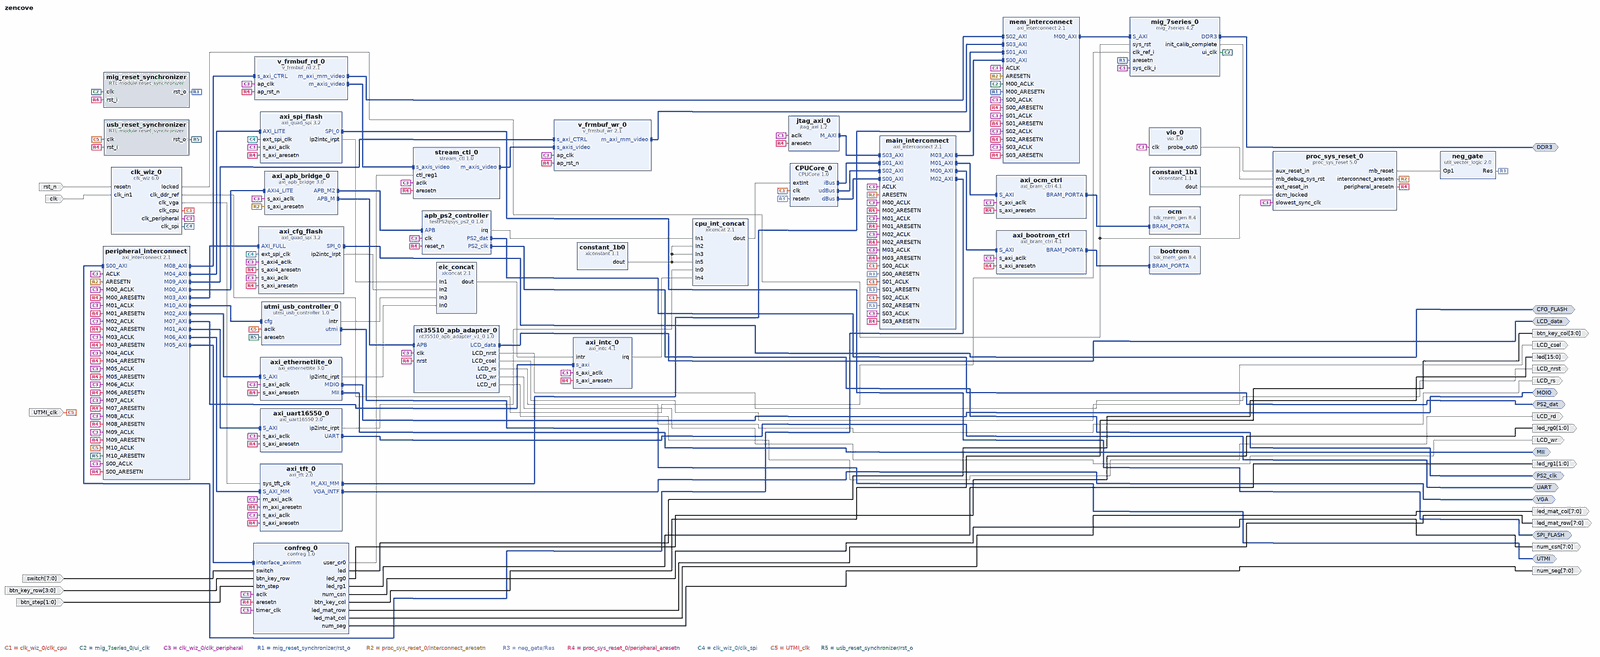
[diagram p0: block diagram of the top level, whole]
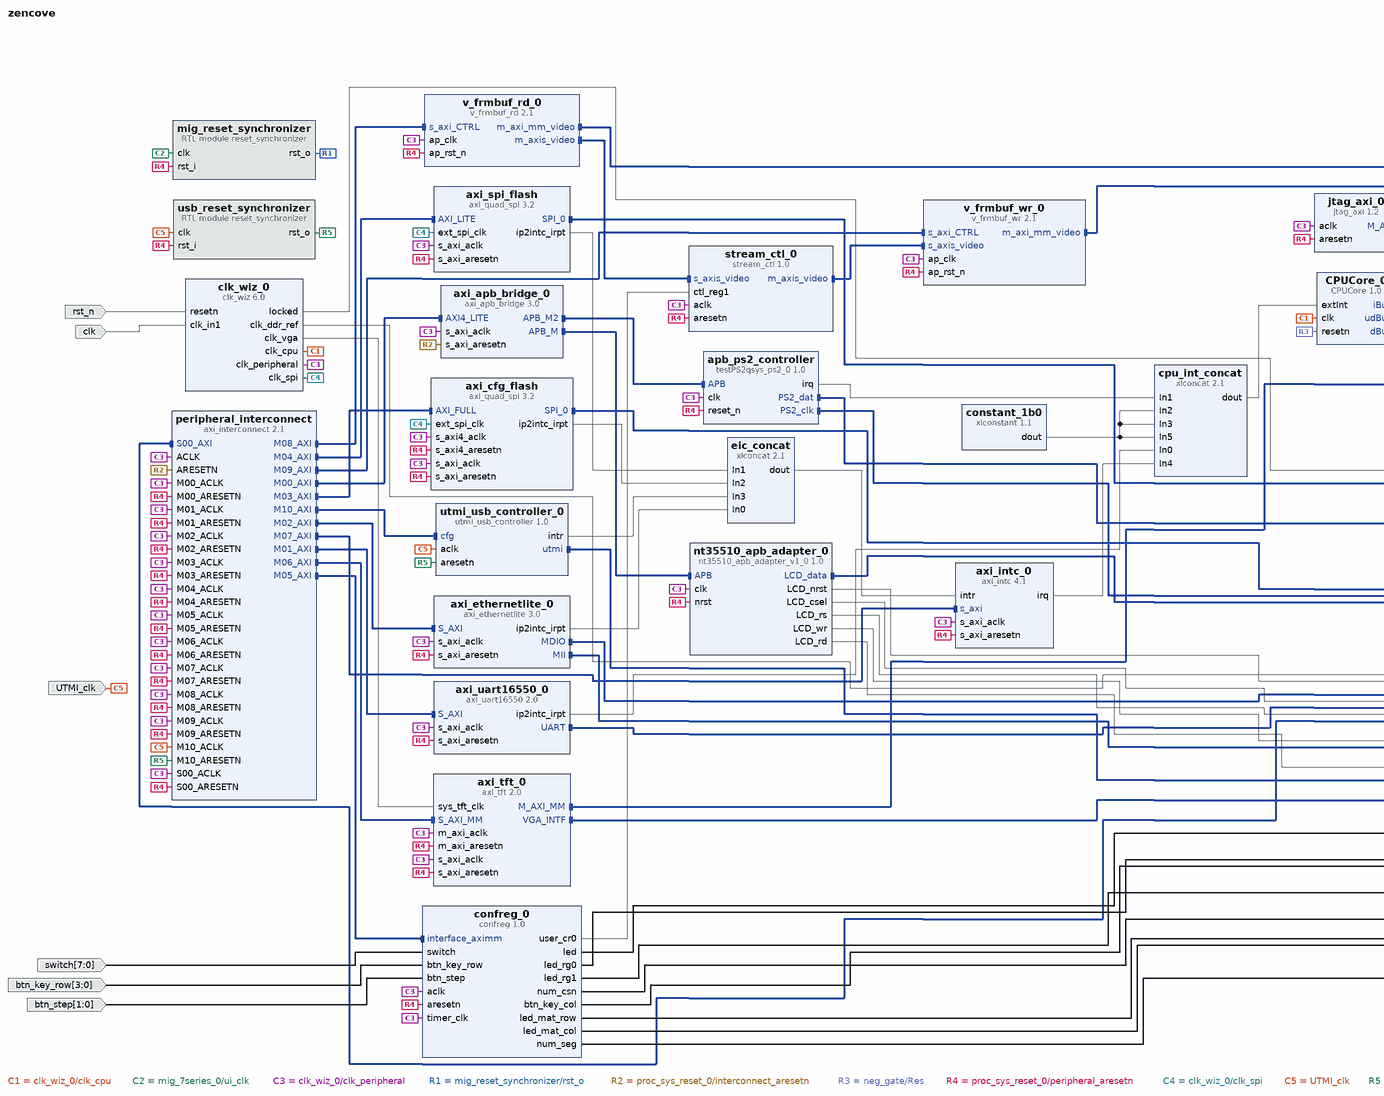
[diagram p1: block diagram of the top level, left part]
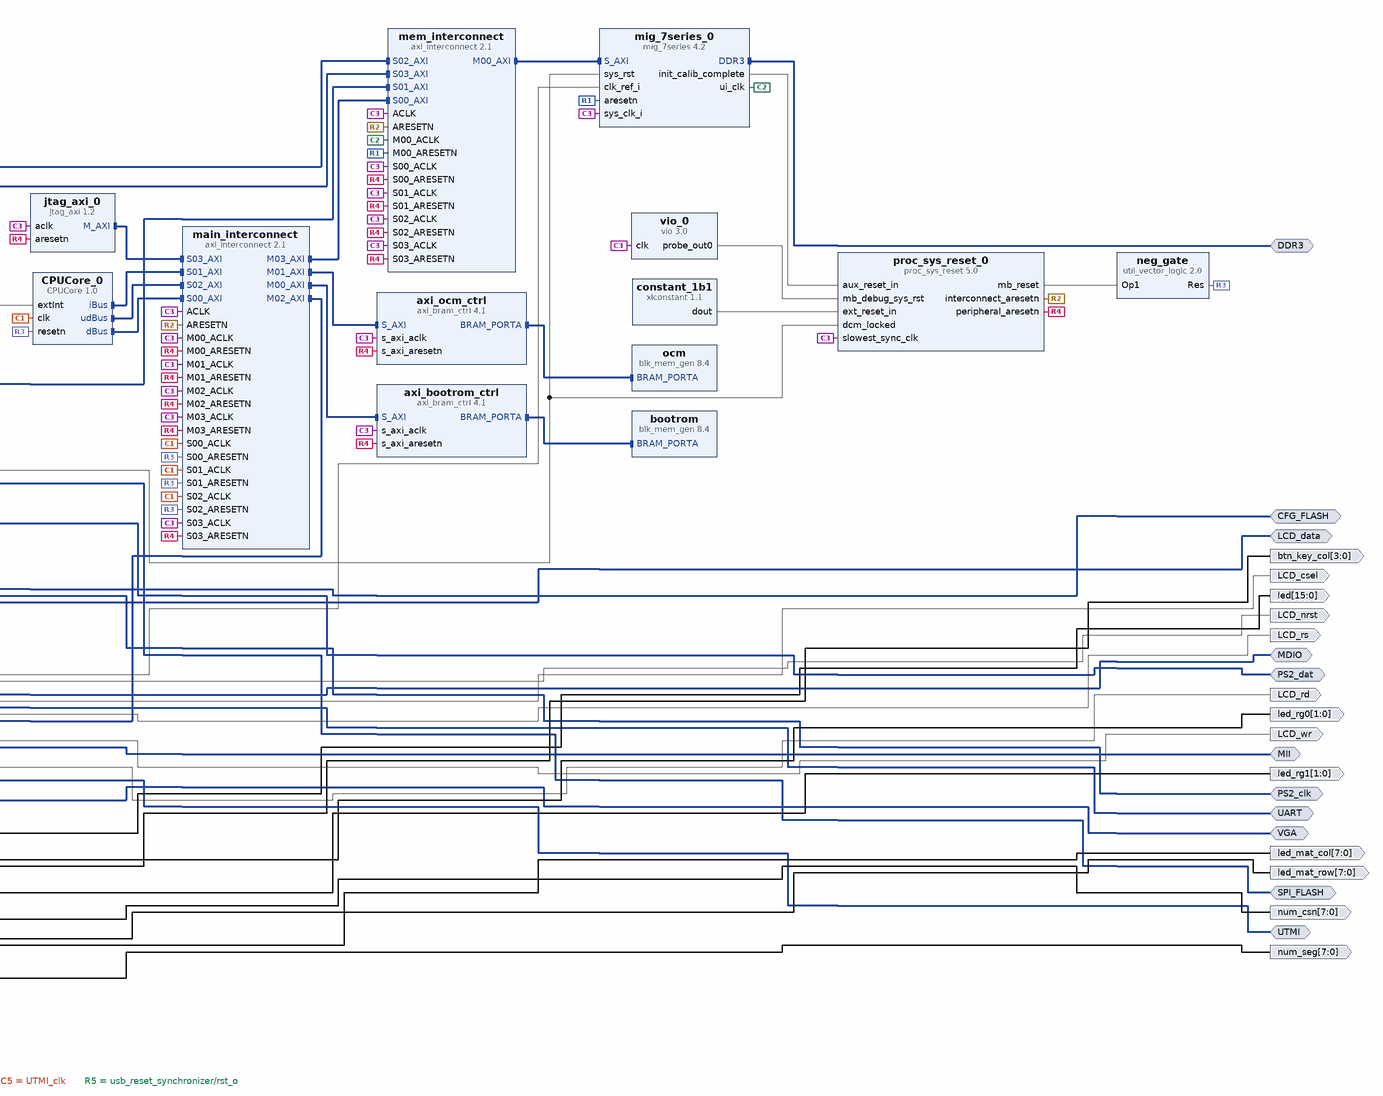
[diagram p2: block diagram of the top level, right part]
# Vivado block design zencove, xc7a200tfbg676-2, Vivado 2019.2
create_bd_design zencove

create_bd_intf_port -mode Master -vlnv xilinx.com:interface:ddrx_rtl:1.0 DDR3
create_bd_intf_port -mode Master -vlnv xilinx.com:interface:vga_rtl:1.0 VGA
create_bd_intf_port -mode Master -vlnv xilinx.com:interface:spi_rtl:1.0 SPI_FLASH
create_bd_intf_port -mode Master -vlnv xilinx.com:interface:spi_rtl:1.0 CFG_FLASH
create_bd_intf_port -mode Master -vlnv xilinx.com:interface:mii_rtl:1.0 MII
create_bd_intf_port -mode Master -vlnv xilinx.com:interface:mdio_rtl:1.0 MDIO
create_bd_intf_port -mode Master -vlnv xilinx.com:interface:uart_rtl:1.0 UART
create_bd_intf_port -mode Master -vlnv xilinx.com:interface:gpio_rtl:1.0 PS2_clk
create_bd_intf_port -mode Master -vlnv xilinx.com:interface:gpio_rtl:1.0 PS2_dat
create_bd_intf_port -mode Master -vlnv xilinx.com:interface:gpio_rtl:1.0 LCD_data
create_bd_intf_port -mode Master -vlnv harrychen.xyz:user:utmi_rtl:1.0 UTMI
create_bd_port -dir I -type rst rst_n
create_bd_port -dir I -type clk clk
create_bd_port -dir O -from 15 -to 0 led
create_bd_port -dir O -from 1 -to 0 led_rg0
create_bd_port -dir O -from 1 -to 0 led_rg1
create_bd_port -dir O -from 7 -to 0 num_csn
create_bd_port -dir O -from 3 -to 0 btn_key_col
create_bd_port -dir I -from 7 -to 0 switch
create_bd_port -dir I -from 3 -to 0 btn_key_row
create_bd_port -dir I -from 1 -to 0 btn_step
create_bd_port -dir O LCD_nrst
create_bd_port -dir O LCD_csel
create_bd_port -dir O LCD_rs
create_bd_port -dir O LCD_wr
create_bd_port -dir O LCD_rd
create_bd_port -dir I -type clk UTMI_clk
set_property -dict {CONFIG.FREQ_HZ 60000000} [get_bd_ports UTMI_clk]
create_bd_port -dir O -from 7 -to 0 led_mat_row
create_bd_port -dir O -from 7 -to 0 led_mat_col
create_bd_port -dir O -from 7 -to 0 num_seg

create_bd_cell -type ip -vlnv xilinx.com:ip:clk_wiz:6.0 clk_wiz_0
set_property -dict [list \
  CONFIG.CLKOUT1_JITTER 127.801 \
  CONFIG.CLKOUT1_PHASE_ERROR 87.180 \
  CONFIG.CLKOUT1_REQUESTED_OUT_FREQ 60 \
  CONFIG.CLKOUT2_JITTER 102.086 \
  CONFIG.CLKOUT2_PHASE_ERROR 87.180 \
  CONFIG.CLKOUT2_REQUESTED_OUT_FREQ 200.000 \
  CONFIG.CLKOUT2_USED true \
  CONFIG.CLKOUT3_JITTER 162.167 \
  CONFIG.CLKOUT3_PHASE_ERROR 87.180 \
  CONFIG.CLKOUT3_REQUESTED_OUT_FREQ 20.000 \
  CONFIG.CLKOUT3_USED true \
  CONFIG.CLKOUT4_JITTER 115.831 \
  CONFIG.CLKOUT4_PHASE_ERROR 87.180 \
  CONFIG.CLKOUT4_USED true \
  CONFIG.CLKOUT5_JITTER 154.057 \
  CONFIG.CLKOUT5_PHASE_ERROR 87.180 \
  CONFIG.CLKOUT5_REQUESTED_OUT_FREQ 25.000 \
  CONFIG.CLKOUT5_USED true \
  CONFIG.CLK_OUT1_PORT clk_cpu \
  CONFIG.CLK_OUT2_PORT clk_ddr_ref \
  CONFIG.CLK_OUT3_PORT clk_spi \
  CONFIG.CLK_OUT4_PORT clk_peripheral \
  CONFIG.CLK_OUT5_PORT clk_vga \
  CONFIG.MMCM_CLKFBOUT_MULT_F 12.000 \
  CONFIG.MMCM_CLKOUT0_DIVIDE_F 20.000 \
  CONFIG.MMCM_CLKOUT1_DIVIDE 6 \
  CONFIG.MMCM_CLKOUT2_DIVIDE 60 \
  CONFIG.MMCM_CLKOUT3_DIVIDE 12 \
  CONFIG.MMCM_CLKOUT4_DIVIDE 48 \
  CONFIG.NUM_OUT_CLKS 5 \
  CONFIG.RESET_PORT resetn \
  CONFIG.RESET_TYPE ACTIVE_LOW \
] [get_bd_cells clk_wiz_0]
create_bd_cell -type ip -vlnv xilinx.com:ip:vio:3.0 vio_0
set_property -dict {CONFIG.C_NUM_PROBE_IN 0} [get_bd_cells vio_0]
create_bd_cell -type ip -vlnv xilinx.com:ip:xlconstant:1.1 constant_1b0
set_property -dict {CONFIG.CONST_VAL 0} [get_bd_cells constant_1b0]
create_bd_cell -type ip -vlnv xilinx.com:ip:proc_sys_reset:5.0 proc_sys_reset_0
set_property -dict {CONFIG.C_AUX_RESET_HIGH 0} [get_bd_cells proc_sys_reset_0]
create_bd_cell -type ip -vlnv xilinx.com:ip:xlconcat:2.1 cpu_int_concat
set_property -dict {CONFIG.NUM_PORTS 6} [get_bd_cells cpu_int_concat]
create_bd_cell -type ip -vlnv xilinx.com:ip:util_vector_logic:2.0 neg_gate
set_property -dict {CONFIG.C_OPERATION not CONFIG.C_SIZE 1} [get_bd_cells neg_gate]
create_bd_cell -type ip -vlnv xilinx.com:ip:jtag_axi:1.2 jtag_axi_0
create_bd_cell -type ip -vlnv xilinx.com:ip:axi_interconnect:2.1 main_interconnect
set_property -dict [list \
  CONFIG.ENABLE_ADVANCED_OPTIONS 1 \
  CONFIG.NUM_MI 4 \
  CONFIG.NUM_SI 4 \
  CONFIG.S00_HAS_DATA_FIFO 2 \
  CONFIG.S01_ARB_PRIORITY 1 \
  CONFIG.S01_HAS_DATA_FIFO 2 \
  CONFIG.S02_ARB_PRIORITY 2 \
  CONFIG.S02_HAS_DATA_FIFO 2 \
  CONFIG.S03_ARB_PRIORITY 3 \
  CONFIG.S03_HAS_DATA_FIFO 2 \
  CONFIG.STRATEGY 2 \
] [get_bd_cells main_interconnect]
create_bd_cell -type ip -vlnv xilinx.com:ip:axi_interconnect:2.1 peripheral_interconnect
set_property -dict {CONFIG.NUM_MI 11 CONFIG.S00_HAS_DATA_FIFO 2 CONFIG.STRATEGY 2} [get_bd_cells peripheral_interconnect]
create_bd_cell -type ip -vlnv xilinx.com:ip:axi_bram_ctrl:4.1 axi_bootrom_ctrl
set_property -dict {CONFIG.SINGLE_PORT_BRAM 1} [get_bd_cells axi_bootrom_ctrl]
create_bd_cell -type ip -vlnv xilinx.com:ip:axi_bram_ctrl:4.1 axi_ocm_ctrl
set_property -dict {CONFIG.SINGLE_PORT_BRAM 1} [get_bd_cells axi_ocm_ctrl]
create_bd_cell -type ip -vlnv xilinx.com:ip:blk_mem_gen:8.4 bootrom
set_property -dict [list \
  CONFIG.Coe_File ../../../../../../bootloader.coe \
  CONFIG.EN_SAFETY_CKT false \
  CONFIG.Enable_32bit_Address true \
  CONFIG.Fill_Remaining_Memory_Locations true \
  CONFIG.Load_Init_File true \
  CONFIG.Register_PortA_Output_of_Memory_Primitives false \
  CONFIG.Use_RSTA_Pin true \
  CONFIG.Write_Depth_A 32768 \
  CONFIG.use_bram_block Stand_Alone \
] [get_bd_cells bootrom]
create_bd_cell -type ip -vlnv xilinx.com:ip:blk_mem_gen:8.4 ocm
set_property -dict [list \
  CONFIG.EN_SAFETY_CKT false \
  CONFIG.Enable_32bit_Address true \
  CONFIG.Register_PortA_Output_of_Memory_Primitives false \
  CONFIG.Use_RSTA_Pin true \
  CONFIG.use_bram_block BRAM_Controller \
] [get_bd_cells ocm]
create_bd_cell -type ip -vlnv xilinx.com:ip:xlconcat:2.1 eic_concat
set_property -dict {CONFIG.NUM_PORTS 4} [get_bd_cells eic_concat]
create_bd_cell -type ip -vlnv xilinx.com:ip:v_frmbuf_rd:2.1 v_frmbuf_rd_0
set_property -dict [list \
  CONFIG.AXIMM_DATA_WIDTH 64 \
  CONFIG.C_M_AXI_MM_VIDEO_DATA_WIDTH 64 \
  CONFIG.HAS_RGB8 0 \
  CONFIG.HAS_RGBX8 1 \
  CONFIG.MAX_COLS 1024 \
  CONFIG.MAX_ROWS 768 \
  CONFIG.SAMPLES_PER_CLOCK 1 \
] [get_bd_cells v_frmbuf_rd_0]
create_bd_cell -type ip -vlnv xilinx.com:ip:v_frmbuf_wr:2.1 v_frmbuf_wr_0
set_property -dict [list \
  CONFIG.AXIMM_DATA_WIDTH 64 \
  CONFIG.C_M_AXI_MM_VIDEO_DATA_WIDTH 64 \
  CONFIG.HAS_RGB8 0 \
  CONFIG.HAS_RGBX8 1 \
  CONFIG.MAX_COLS 1024 \
  CONFIG.MAX_ROWS 768 \
  CONFIG.SAMPLES_PER_CLOCK 1 \
] [get_bd_cells v_frmbuf_wr_0]
create_bd_cell -type ip -vlnv user.org:user:stream_ctl:1.0 stream_ctl_0
create_bd_cell -type ip -vlnv xilinx.com:ip:axi_interconnect:2.1 mem_interconnect
set_property -dict [list \
  CONFIG.NUM_MI 1 \
  CONFIG.NUM_SI 4 \
  CONFIG.S00_HAS_DATA_FIFO 0 \
  CONFIG.S01_HAS_DATA_FIFO 0 \
  CONFIG.S02_HAS_DATA_FIFO 0 \
  CONFIG.S03_HAS_DATA_FIFO 0 \
  CONFIG.STRATEGY 1 \
] [get_bd_cells mem_interconnect]
create_bd_cell -type ip -vlnv xilinx.com:ip:axi_apb_bridge:3.0 axi_apb_bridge_0
set_property -dict {CONFIG.C_APB_NUM_SLAVES 2 CONFIG.C_M_APB_PROTOCOL apb4} [get_bd_cells axi_apb_bridge_0]
create_bd_cell -type ip -vlnv xilinx.com:ip:axi_uart16550:2.0 axi_uart16550_0
create_bd_cell -type ip -vlnv xilinx.com:ip:axi_ethernetlite:3.0 axi_ethernetlite_0
create_bd_cell -type ip -vlnv xilinx.com:ip:axi_quad_spi:3.2 axi_cfg_flash
set_property -dict {CONFIG.C_SPI_MEMORY 3 CONFIG.C_TYPE_OF_AXI4_INTERFACE 1 CONFIG.C_XIP_MODE 1} [get_bd_cells axi_cfg_flash]
create_bd_cell -type ip -vlnv xilinx.com:ip:axi_quad_spi:3.2 axi_spi_flash
set_property -dict {CONFIG.C_FIFO_DEPTH 256 CONFIG.C_SPI_MODE 2 CONFIG.C_USE_STARTUP 0} [get_bd_cells axi_spi_flash]
create_bd_cell -type ip -vlnv xilinx.com:ip:axi_tft:2.0 axi_tft_0
set_property -dict {CONFIG.C_EN_I2C_INTF 0 CONFIG.C_MAX_BURST_LEN 128 CONFIG.C_TFT_INTERFACE 0} [get_bd_cells axi_tft_0]
create_bd_cell -type module -reference reset_synchronizer mig_reset_synchronizer
create_bd_cell -type ip -vlnv user.org:user:nt35510_apb_adapter_v1_0:1.0 nt35510_apb_adapter_0
create_bd_cell -type ip -vlnv xilinx.com:ip:axi_intc:4.1 axi_intc_0
set_property -dict {CONFIG.C_IRQ_CONNECTION 1} [get_bd_cells axi_intc_0]
create_bd_cell -type ip -vlnv user.org:user:testPS2qsys_ps2_0:1.0 apb_ps2_controller
create_bd_cell -type ip -vlnv xilinx.com:ip:xlconstant:1.1 constant_1b1
create_bd_cell -type module -reference reset_synchronizer usb_reset_synchronizer
create_bd_cell -type ip -vlnv xilinx.com:ip:mig_7series:4.2 mig_7series_0
set_property -dict [list \
  CONFIG.BOARD_MIG_PARAM Custom \
  CONFIG.MIG_DONT_TOUCH_PARAM Custom \
  CONFIG.RESET_BOARD_INTERFACE Custom \
  CONFIG.XML_INPUT_FILE mig_a.prj \
] [get_bd_cells mig_7series_0]
create_bd_cell -type ip -vlnv user.org:user:confreg:1.0 confreg_0
create_bd_cell -type ip -vlnv jiege.ch:user:utmi_usb_controller:1.0 utmi_usb_controller_0
create_bd_cell -type ip -vlnv user.org:user:CPUCore:1.0 CPUCore_0

# ---- connections ----

connect_bd_intf_net -intf_net testPS2qsys_ps2_0_0_PS2_dat [get_bd_intf_ports PS2_dat] [get_bd_intf_pins apb_ps2_controller/PS2_dat]
connect_bd_intf_net [get_bd_intf_ports LCD_data] [get_bd_intf_pins nt35510_apb_adapter_0/LCD_data]
connect_bd_intf_net [get_bd_intf_pins main_interconnect/M03_AXI] [get_bd_intf_pins mem_interconnect/S00_AXI]
connect_bd_intf_net [get_bd_intf_ports VGA] [get_bd_intf_pins axi_tft_0/VGA_INTF]
connect_bd_intf_net [get_bd_intf_pins axi_apb_bridge_0/APB_M2] [get_bd_intf_pins apb_ps2_controller/APB]
connect_bd_intf_net [get_bd_intf_pins jtag_axi_0/M_AXI] [get_bd_intf_pins main_interconnect/S03_AXI]
connect_bd_intf_net [get_bd_intf_pins main_interconnect/M00_AXI] [get_bd_intf_pins axi_bootrom_ctrl/S_AXI]
connect_bd_intf_net [get_bd_intf_pins peripheral_interconnect/M03_AXI] [get_bd_intf_pins axi_cfg_flash/AXI_FULL]
connect_bd_intf_net [get_bd_intf_pins axi_bootrom_ctrl/BRAM_PORTA] [get_bd_intf_pins bootrom/BRAM_PORTA]
connect_bd_intf_net [get_bd_intf_ports UART] [get_bd_intf_pins axi_uart16550_0/UART]
connect_bd_intf_net [get_bd_intf_pins main_interconnect/M02_AXI] [get_bd_intf_pins peripheral_interconnect/S00_AXI]
connect_bd_intf_net [get_bd_intf_pins axi_apb_bridge_0/APB_M] [get_bd_intf_pins nt35510_apb_adapter_0/APB]
connect_bd_intf_net [get_bd_intf_ports CFG_FLASH] [get_bd_intf_pins axi_cfg_flash/SPI_0]
connect_bd_intf_net [get_bd_intf_pins axi_ocm_ctrl/BRAM_PORTA] [get_bd_intf_pins ocm/BRAM_PORTA]
connect_bd_intf_net -intf_net testPS2qsys_ps2_0_0_PS2_clk [get_bd_intf_ports PS2_clk] [get_bd_intf_pins apb_ps2_controller/PS2_clk]
connect_bd_intf_net [get_bd_intf_pins peripheral_interconnect/M06_AXI] [get_bd_intf_pins axi_tft_0/S_AXI_MM]
connect_bd_intf_net [get_bd_intf_pins CPUCore_0/iBus] [get_bd_intf_pins main_interconnect/S01_AXI]
connect_bd_intf_net [get_bd_intf_ports SPI_FLASH] [get_bd_intf_pins axi_spi_flash/SPI_0]
connect_bd_intf_net [get_bd_intf_pins mem_interconnect/M00_AXI] [get_bd_intf_pins mig_7series_0/S_AXI]
connect_bd_intf_net [get_bd_intf_pins v_frmbuf_wr_0/m_axi_mm_video] [get_bd_intf_pins mem_interconnect/S03_AXI]
connect_bd_intf_net [get_bd_intf_pins CPUCore_0/udBus] [get_bd_intf_pins main_interconnect/S02_AXI]
connect_bd_intf_net [get_bd_intf_ports MDIO] [get_bd_intf_pins axi_ethernetlite_0/MDIO]
connect_bd_intf_net [get_bd_intf_pins v_frmbuf_rd_0/m_axi_mm_video] [get_bd_intf_pins mem_interconnect/S02_AXI]
connect_bd_intf_net [get_bd_intf_pins peripheral_interconnect/M04_AXI] [get_bd_intf_pins axi_spi_flash/AXI_LITE]
connect_bd_intf_net [get_bd_intf_pins CPUCore_0/dBus] [get_bd_intf_pins main_interconnect/S00_AXI]
connect_bd_intf_net [get_bd_intf_pins peripheral_interconnect/M00_AXI] [get_bd_intf_pins axi_apb_bridge_0/AXI4_LITE]
connect_bd_intf_net [get_bd_intf_pins peripheral_interconnect/M05_AXI] [get_bd_intf_pins confreg_0/interface_aximm]
connect_bd_intf_net [get_bd_intf_pins peripheral_interconnect/M08_AXI] [get_bd_intf_pins v_frmbuf_rd_0/s_axi_CTRL]
connect_bd_intf_net [get_bd_intf_pins axi_tft_0/M_AXI_MM] [get_bd_intf_pins mem_interconnect/S01_AXI]
connect_bd_intf_net [get_bd_intf_pins peripheral_interconnect/M01_AXI] [get_bd_intf_pins axi_uart16550_0/S_AXI]
connect_bd_intf_net [get_bd_intf_ports MII] [get_bd_intf_pins axi_ethernetlite_0/MII]
connect_bd_intf_net [get_bd_intf_pins v_frmbuf_rd_0/m_axis_video] [get_bd_intf_pins stream_ctl_0/s_axis_video]
connect_bd_intf_net [get_bd_intf_pins peripheral_interconnect/M02_AXI] [get_bd_intf_pins axi_ethernetlite_0/S_AXI]
connect_bd_intf_net [get_bd_intf_pins main_interconnect/M01_AXI] [get_bd_intf_pins axi_ocm_ctrl/S_AXI]
connect_bd_intf_net [get_bd_intf_pins stream_ctl_0/m_axis_video] [get_bd_intf_pins v_frmbuf_wr_0/s_axis_video]
connect_bd_intf_net [get_bd_intf_pins peripheral_interconnect/M09_AXI] [get_bd_intf_pins v_frmbuf_wr_0/s_axi_CTRL]
connect_bd_intf_net [get_bd_intf_pins peripheral_interconnect/M10_AXI] [get_bd_intf_pins utmi_usb_controller_0/cfg]
connect_bd_intf_net [get_bd_intf_ports DDR3] [get_bd_intf_pins mig_7series_0/DDR3]
connect_bd_intf_net [get_bd_intf_pins peripheral_interconnect/M07_AXI] [get_bd_intf_pins axi_intc_0/s_axi]
connect_bd_intf_net [get_bd_intf_ports UTMI] [get_bd_intf_pins utmi_usb_controller_0/utmi]
connect_bd_net -net resetn_0_1 [get_bd_ports rst_n] [get_bd_pins clk_wiz_0/resetn]
connect_bd_net -net clk_in1_0_1 [get_bd_ports clk] [get_bd_pins clk_wiz_0/clk_in1]
connect_bd_net [get_bd_pins clk_wiz_0/clk_cpu] \
  [get_bd_pins main_interconnect/S00_ACLK] [get_bd_pins main_interconnect/S01_ACLK] [get_bd_pins main_interconnect/S02_ACLK] \
  [get_bd_pins CPUCore_0/clk]
connect_bd_net [get_bd_pins clk_wiz_0/clk_vga] [get_bd_pins axi_tft_0/sys_tft_clk]
connect_bd_net [get_bd_pins mig_7series_0/ui_clk] [get_bd_pins mem_interconnect/M00_ACLK] [get_bd_pins mig_reset_synchronizer/clk]
connect_bd_net [get_bd_pins clk_wiz_0/clk_peripheral] \
  [get_bd_pins vio_0/clk] [get_bd_pins proc_sys_reset_0/slowest_sync_clk] [get_bd_pins main_interconnect/ACLK] \
  [get_bd_pins main_interconnect/M00_ACLK] [get_bd_pins main_interconnect/M01_ACLK] [get_bd_pins main_interconnect/S03_ACLK] \
  [get_bd_pins main_interconnect/M02_ACLK] [get_bd_pins main_interconnect/M03_ACLK] [get_bd_pins jtag_axi_0/aclk] \
  [get_bd_pins v_frmbuf_rd_0/ap_clk] [get_bd_pins stream_ctl_0/aclk] [get_bd_pins v_frmbuf_wr_0/ap_clk] \
  [get_bd_pins mem_interconnect/ACLK] [get_bd_pins mem_interconnect/S00_ACLK] [get_bd_pins mem_interconnect/S01_ACLK] \
  [get_bd_pins mem_interconnect/S02_ACLK] [get_bd_pins mem_interconnect/S03_ACLK] [get_bd_pins axi_spi_flash/s_axi_aclk] \
  [get_bd_pins axi_cfg_flash/s_axi4_aclk] [get_bd_pins axi_cfg_flash/s_axi_aclk] [get_bd_pins axi_ethernetlite_0/s_axi_aclk] \
  [get_bd_pins axi_uart16550_0/s_axi_aclk] [get_bd_pins axi_apb_bridge_0/s_axi_aclk] \
  [get_bd_pins axi_bootrom_ctrl/s_axi_aclk] [get_bd_pins axi_ocm_ctrl/s_axi_aclk] [get_bd_pins peripheral_interconnect/ACLK] \
  [get_bd_pins peripheral_interconnect/S00_ACLK] [get_bd_pins peripheral_interconnect/M00_ACLK] \
  [get_bd_pins peripheral_interconnect/M01_ACLK] [get_bd_pins peripheral_interconnect/M02_ACLK] \
  [get_bd_pins peripheral_interconnect/M03_ACLK] [get_bd_pins peripheral_interconnect/M04_ACLK] \
  [get_bd_pins peripheral_interconnect/M05_ACLK] [get_bd_pins peripheral_interconnect/M06_ACLK] \
  [get_bd_pins peripheral_interconnect/M07_ACLK] [get_bd_pins peripheral_interconnect/M08_ACLK] \
  [get_bd_pins peripheral_interconnect/M09_ACLK] [get_bd_pins axi_tft_0/s_axi_aclk] [get_bd_pins axi_tft_0/m_axi_aclk] \
  [get_bd_pins nt35510_apb_adapter_0/clk] [get_bd_pins axi_intc_0/s_axi_aclk] [get_bd_pins apb_ps2_controller/clk] \
  [get_bd_pins mig_7series_0/sys_clk_i] [get_bd_pins confreg_0/aclk] [get_bd_pins confreg_0/timer_clk]
connect_bd_net [get_bd_pins constant_1b0/dout] [get_bd_pins cpu_int_concat/In2] [get_bd_pins cpu_int_concat/In3] [get_bd_pins cpu_int_concat/In5]
connect_bd_net [get_bd_pins clk_wiz_0/locked] [get_bd_pins proc_sys_reset_0/dcm_locked] [get_bd_pins mig_7series_0/sys_rst]
connect_bd_net [get_bd_pins vio_0/probe_out0] [get_bd_pins proc_sys_reset_0/mb_debug_sys_rst]
connect_bd_net -net reset_synchronizer_0_rst_o [get_bd_pins mig_reset_synchronizer/rst_o] \
  [get_bd_pins mem_interconnect/M00_ARESETN] [get_bd_pins mig_7series_0/aresetn]
connect_bd_net [get_bd_pins proc_sys_reset_0/mb_reset] [get_bd_pins neg_gate/Op1]
connect_bd_net [get_bd_pins proc_sys_reset_0/interconnect_aresetn] \
  [get_bd_pins main_interconnect/ARESETN] [get_bd_pins mem_interconnect/ARESETN] [get_bd_pins axi_apb_bridge_0/s_axi_aresetn] \
  [get_bd_pins peripheral_interconnect/ARESETN]
connect_bd_net [get_bd_pins neg_gate/Res] \
  [get_bd_pins main_interconnect/S00_ARESETN] [get_bd_pins main_interconnect/S01_ARESETN] \
  [get_bd_pins main_interconnect/S02_ARESETN] [get_bd_pins CPUCore_0/resetn]
connect_bd_net [get_bd_pins proc_sys_reset_0/peripheral_aresetn] \
  [get_bd_pins jtag_axi_0/aresetn] [get_bd_pins main_interconnect/S03_ARESETN] [get_bd_pins main_interconnect/M02_ARESETN] \
  [get_bd_pins main_interconnect/M03_ARESETN] [get_bd_pins main_interconnect/M00_ARESETN] \
  [get_bd_pins main_interconnect/M01_ARESETN] [get_bd_pins peripheral_interconnect/S00_ARESETN] \
  [get_bd_pins peripheral_interconnect/M00_ARESETN] [get_bd_pins peripheral_interconnect/M01_ARESETN] \
  [get_bd_pins peripheral_interconnect/M02_ARESETN] [get_bd_pins peripheral_interconnect/M03_ARESETN] \
  [get_bd_pins peripheral_interconnect/M04_ARESETN] [get_bd_pins peripheral_interconnect/M05_ARESETN] \
  [get_bd_pins peripheral_interconnect/M06_ARESETN] [get_bd_pins peripheral_interconnect/M07_ARESETN] \
  [get_bd_pins peripheral_interconnect/M08_ARESETN] [get_bd_pins peripheral_interconnect/M09_ARESETN] \
  [get_bd_pins axi_bootrom_ctrl/s_axi_aresetn] [get_bd_pins axi_ocm_ctrl/s_axi_aresetn] \
  [get_bd_pins axi_uart16550_0/s_axi_aresetn] [get_bd_pins axi_ethernetlite_0/s_axi_aresetn] \
  [get_bd_pins axi_cfg_flash/s_axi_aresetn] [get_bd_pins axi_cfg_flash/s_axi4_aresetn] \
  [get_bd_pins axi_spi_flash/s_axi_aresetn] [get_bd_pins axi_tft_0/s_axi_aresetn] [get_bd_pins axi_tft_0/m_axi_aresetn] \
  [get_bd_pins v_frmbuf_rd_0/ap_rst_n] [get_bd_pins stream_ctl_0/aresetn] [get_bd_pins v_frmbuf_wr_0/ap_rst_n] \
  [get_bd_pins mig_reset_synchronizer/rst_i] [get_bd_pins mem_interconnect/S00_ARESETN] \
  [get_bd_pins mem_interconnect/S01_ARESETN] [get_bd_pins mem_interconnect/S02_ARESETN] \
  [get_bd_pins mem_interconnect/S03_ARESETN] [get_bd_pins nt35510_apb_adapter_0/nrst] [get_bd_pins axi_intc_0/s_axi_aresetn] \
  [get_bd_pins apb_ps2_controller/reset_n] [get_bd_pins usb_reset_synchronizer/rst_i] [get_bd_pins confreg_0/aresetn]
connect_bd_net [get_bd_pins eic_concat/dout] [get_bd_pins axi_intc_0/intr]
connect_bd_net [get_bd_pins axi_ethernetlite_0/ip2intc_irpt] [get_bd_pins eic_concat/In0]
connect_bd_net [get_bd_pins axi_spi_flash/ip2intc_irpt] [get_bd_pins eic_concat/In1]
connect_bd_net [get_bd_pins axi_cfg_flash/ip2intc_irpt] [get_bd_pins eic_concat/In2]
connect_bd_net [get_bd_pins axi_intc_0/irq] [get_bd_pins cpu_int_concat/In4]
connect_bd_net [get_bd_pins cpu_int_concat/dout] [get_bd_pins CPUCore_0/extInt]
connect_bd_net [get_bd_pins axi_uart16550_0/ip2intc_irpt] [get_bd_pins cpu_int_concat/In0]
connect_bd_net -net testPS2qsys_ps2_0_0_irq [get_bd_pins apb_ps2_controller/irq] [get_bd_pins cpu_int_concat/In1]
connect_bd_net [get_bd_pins confreg_0/led] [get_bd_ports led]
connect_bd_net [get_bd_pins confreg_0/led_rg0] [get_bd_ports led_rg0]
connect_bd_net [get_bd_pins confreg_0/led_rg1] [get_bd_ports led_rg1]
connect_bd_net [get_bd_pins confreg_0/num_csn] [get_bd_ports num_csn]
connect_bd_net [get_bd_pins confreg_0/btn_key_col] [get_bd_ports btn_key_col]
connect_bd_net [get_bd_pins confreg_0/user_cr0] [get_bd_pins stream_ctl_0/ctl_reg1]
connect_bd_net -net switch_0_1 [get_bd_ports switch] [get_bd_pins confreg_0/switch]
connect_bd_net -net btn_key_row_0_1 [get_bd_ports btn_key_row] [get_bd_pins confreg_0/btn_key_row]
connect_bd_net -net btn_step_0_1 [get_bd_ports btn_step] [get_bd_pins confreg_0/btn_step]
connect_bd_net [get_bd_pins clk_wiz_0/clk_spi] [get_bd_pins axi_cfg_flash/ext_spi_clk] [get_bd_pins axi_spi_flash/ext_spi_clk]
connect_bd_net [get_bd_pins nt35510_apb_adapter_0/LCD_nrst] [get_bd_ports LCD_nrst]
connect_bd_net [get_bd_pins nt35510_apb_adapter_0/LCD_csel] [get_bd_ports LCD_csel]
connect_bd_net [get_bd_pins nt35510_apb_adapter_0/LCD_rs] [get_bd_ports LCD_rs]
connect_bd_net [get_bd_pins nt35510_apb_adapter_0/LCD_wr] [get_bd_ports LCD_wr]
connect_bd_net [get_bd_pins nt35510_apb_adapter_0/LCD_rd] [get_bd_ports LCD_rd]
connect_bd_net [get_bd_pins mig_7series_0/init_calib_complete] [get_bd_pins proc_sys_reset_0/aux_reset_in]
connect_bd_net [get_bd_pins clk_wiz_0/clk_ddr_ref] [get_bd_pins mig_7series_0/clk_ref_i]
connect_bd_net [get_bd_pins constant_1b1/dout] [get_bd_pins proc_sys_reset_0/ext_reset_in]
connect_bd_net -net clk_0_1 [get_bd_ports UTMI_clk] \
  [get_bd_pins peripheral_interconnect/M10_ACLK] [get_bd_pins usb_reset_synchronizer/clk] \
  [get_bd_pins utmi_usb_controller_0/aclk]
connect_bd_net [get_bd_pins usb_reset_synchronizer/rst_o] \
  [get_bd_pins peripheral_interconnect/M10_ARESETN] [get_bd_pins utmi_usb_controller_0/aresetn]
connect_bd_net [get_bd_pins confreg_0/led_mat_row] [get_bd_ports led_mat_row]
connect_bd_net [get_bd_pins confreg_0/led_mat_col] [get_bd_ports led_mat_col]
connect_bd_net [get_bd_pins confreg_0/num_seg] [get_bd_ports num_seg]
connect_bd_net [get_bd_pins utmi_usb_controller_0/intr] [get_bd_pins eic_concat/In3]

# ---- address map ----
assign_bd_address -offset 0x00000000 -range 128M -target_address_space [get_bd_addr_spaces axi_tft_0/Video_data] [get_bd_addr_segs mig_7series_0/memmap/memaddr]
assign_bd_address -offset 0x00000000 -range 128M -target_address_space [get_bd_addr_spaces CPUCore_0/dBus] [get_bd_addr_segs mig_7series_0/memmap/memaddr]
assign_bd_address -offset 0x08000000 -range 64K -target_address_space [get_bd_addr_spaces CPUCore_0/dBus] [get_bd_addr_segs axi_ocm_ctrl/S_AXI/Mem0]
assign_bd_address -offset 0x1A000000 -range 16M -target_address_space [get_bd_addr_spaces CPUCore_0/dBus] [get_bd_addr_segs axi_cfg_flash/aximm/MEM0]
assign_bd_address -offset 0x1C000000 -range 64K -target_address_space [get_bd_addr_spaces CPUCore_0/dBus] [get_bd_addr_segs axi_ethernetlite_0/S_AXI/Reg]
assign_bd_address -offset 0x1C010000 -range 64K -target_address_space [get_bd_addr_spaces CPUCore_0/dBus] [get_bd_addr_segs axi_tft_0/S_AXI_MM/Reg]
assign_bd_address -offset 0x1C020000 -range 4K -target_address_space [get_bd_addr_spaces CPUCore_0/dBus] [get_bd_addr_segs apb_ps2_controller/APB/Reg]
assign_bd_address -offset 0x1C030000 -range 4K -target_address_space [get_bd_addr_spaces CPUCore_0/dBus] [get_bd_addr_segs nt35510_apb_adapter_0/APB/Reg]
assign_bd_address -offset 0x1C040000 -range 4K -target_address_space [get_bd_addr_spaces CPUCore_0/dBus] [get_bd_addr_segs axi_spi_flash/AXI_LITE/Reg]
assign_bd_address -offset 0x1C050000 -range 64K -target_address_space [get_bd_addr_spaces CPUCore_0/dBus] [get_bd_addr_segs v_frmbuf_rd_0/s_axi_CTRL/Reg]
assign_bd_address -offset 0x1C060000 -range 64K -target_address_space [get_bd_addr_spaces CPUCore_0/dBus] [get_bd_addr_segs v_frmbuf_wr_0/s_axi_CTRL/Reg]
assign_bd_address -offset 0x1C070000 -range 64K -target_address_space [get_bd_addr_spaces CPUCore_0/dBus] [get_bd_addr_segs utmi_usb_controller_0/cfg/reg0]
assign_bd_address -offset 0x1D000000 -range 64K -target_address_space [get_bd_addr_spaces CPUCore_0/dBus] [get_bd_addr_segs axi_intc_0/S_AXI/Reg]
assign_bd_address -offset 0x1FC00000 -range 128K -target_address_space [get_bd_addr_spaces CPUCore_0/dBus] [get_bd_addr_segs axi_bootrom_ctrl/S_AXI/Mem0]
assign_bd_address -offset 0x1FD02000 -range 8K -target_address_space [get_bd_addr_spaces CPUCore_0/dBus] [get_bd_addr_segs axi_uart16550_0/S_AXI/Reg]
assign_bd_address -offset 0x1FF00000 -range 64K -target_address_space [get_bd_addr_spaces CPUCore_0/dBus] [get_bd_addr_segs confreg_0/interface_aximm/reg0]
assign_bd_address -offset 0x00000000 -range 128M -target_address_space [get_bd_addr_spaces CPUCore_0/iBus] [get_bd_addr_segs mig_7series_0/memmap/memaddr]
assign_bd_address -offset 0x08000000 -range 64K -target_address_space [get_bd_addr_spaces CPUCore_0/iBus] [get_bd_addr_segs axi_ocm_ctrl/S_AXI/Mem0]
assign_bd_address -offset 0x1A000000 -range 16M -target_address_space [get_bd_addr_spaces CPUCore_0/iBus] [get_bd_addr_segs axi_cfg_flash/aximm/MEM0]
assign_bd_address -offset 0x1C000000 -range 64K -target_address_space [get_bd_addr_spaces CPUCore_0/iBus] [get_bd_addr_segs axi_ethernetlite_0/S_AXI/Reg]
assign_bd_address -offset 0x1C010000 -range 64K -target_address_space [get_bd_addr_spaces CPUCore_0/iBus] [get_bd_addr_segs axi_tft_0/S_AXI_MM/Reg]
assign_bd_address -offset 0x1C020000 -range 4K -target_address_space [get_bd_addr_spaces CPUCore_0/iBus] [get_bd_addr_segs apb_ps2_controller/APB/Reg]
assign_bd_address -offset 0x1C030000 -range 4K -target_address_space [get_bd_addr_spaces CPUCore_0/iBus] [get_bd_addr_segs nt35510_apb_adapter_0/APB/Reg]
assign_bd_address -offset 0x1C040000 -range 4K -target_address_space [get_bd_addr_spaces CPUCore_0/iBus] [get_bd_addr_segs axi_spi_flash/AXI_LITE/Reg]
assign_bd_address -offset 0x1C050000 -range 64K -target_address_space [get_bd_addr_spaces CPUCore_0/iBus] [get_bd_addr_segs v_frmbuf_rd_0/s_axi_CTRL/Reg]
assign_bd_address -offset 0x1C060000 -range 64K -target_address_space [get_bd_addr_spaces CPUCore_0/iBus] [get_bd_addr_segs v_frmbuf_wr_0/s_axi_CTRL/Reg]
assign_bd_address -offset 0x1C070000 -range 64K -target_address_space [get_bd_addr_spaces CPUCore_0/iBus] [get_bd_addr_segs utmi_usb_controller_0/cfg/reg0]
assign_bd_address -offset 0x1D000000 -range 64K -target_address_space [get_bd_addr_spaces CPUCore_0/iBus] [get_bd_addr_segs axi_intc_0/S_AXI/Reg]
assign_bd_address -offset 0x1FC00000 -range 128K -target_address_space [get_bd_addr_spaces CPUCore_0/iBus] [get_bd_addr_segs axi_bootrom_ctrl/S_AXI/Mem0]
assign_bd_address -offset 0x1FD02000 -range 8K -target_address_space [get_bd_addr_spaces CPUCore_0/iBus] [get_bd_addr_segs axi_uart16550_0/S_AXI/Reg]
assign_bd_address -offset 0x1FF00000 -range 64K -target_address_space [get_bd_addr_spaces CPUCore_0/iBus] [get_bd_addr_segs confreg_0/interface_aximm/reg0]
assign_bd_address -offset 0x00000000 -range 128M -target_address_space [get_bd_addr_spaces CPUCore_0/udBus] [get_bd_addr_segs mig_7series_0/memmap/memaddr]
assign_bd_address -offset 0x08000000 -range 64K -target_address_space [get_bd_addr_spaces CPUCore_0/udBus] [get_bd_addr_segs axi_ocm_ctrl/S_AXI/Mem0]
assign_bd_address -offset 0x1A000000 -range 16M -target_address_space [get_bd_addr_spaces CPUCore_0/udBus] [get_bd_addr_segs axi_cfg_flash/aximm/MEM0]
assign_bd_address -offset 0x1C000000 -range 64K -target_address_space [get_bd_addr_spaces CPUCore_0/udBus] [get_bd_addr_segs axi_ethernetlite_0/S_AXI/Reg]
assign_bd_address -offset 0x1C010000 -range 64K -target_address_space [get_bd_addr_spaces CPUCore_0/udBus] [get_bd_addr_segs axi_tft_0/S_AXI_MM/Reg]
assign_bd_address -offset 0x1C020000 -range 4K -target_address_space [get_bd_addr_spaces CPUCore_0/udBus] [get_bd_addr_segs apb_ps2_controller/APB/Reg]
assign_bd_address -offset 0x1C030000 -range 4K -target_address_space [get_bd_addr_spaces CPUCore_0/udBus] [get_bd_addr_segs nt35510_apb_adapter_0/APB/Reg]
assign_bd_address -offset 0x1C040000 -range 4K -target_address_space [get_bd_addr_spaces CPUCore_0/udBus] [get_bd_addr_segs axi_spi_flash/AXI_LITE/Reg]
assign_bd_address -offset 0x1C050000 -range 64K -target_address_space [get_bd_addr_spaces CPUCore_0/udBus] [get_bd_addr_segs v_frmbuf_rd_0/s_axi_CTRL/Reg]
assign_bd_address -offset 0x1C060000 -range 64K -target_address_space [get_bd_addr_spaces CPUCore_0/udBus] [get_bd_addr_segs v_frmbuf_wr_0/s_axi_CTRL/Reg]
assign_bd_address -offset 0x1C070000 -range 64K -target_address_space [get_bd_addr_spaces CPUCore_0/udBus] [get_bd_addr_segs utmi_usb_controller_0/cfg/reg0]
assign_bd_address -offset 0x1D000000 -range 64K -target_address_space [get_bd_addr_spaces CPUCore_0/udBus] [get_bd_addr_segs axi_intc_0/S_AXI/Reg]
assign_bd_address -offset 0x1FC00000 -range 128K -target_address_space [get_bd_addr_spaces CPUCore_0/udBus] [get_bd_addr_segs axi_bootrom_ctrl/S_AXI/Mem0]
assign_bd_address -offset 0x1FD02000 -range 8K -target_address_space [get_bd_addr_spaces CPUCore_0/udBus] [get_bd_addr_segs axi_uart16550_0/S_AXI/Reg]
assign_bd_address -offset 0x1FF00000 -range 64K -target_address_space [get_bd_addr_spaces CPUCore_0/udBus] [get_bd_addr_segs confreg_0/interface_aximm/reg0]
assign_bd_address -offset 0x00000000 -range 128M -target_address_space [get_bd_addr_spaces jtag_axi_0/Data] [get_bd_addr_segs mig_7series_0/memmap/memaddr]
assign_bd_address -offset 0x08000000 -range 64K -target_address_space [get_bd_addr_spaces jtag_axi_0/Data] [get_bd_addr_segs axi_ocm_ctrl/S_AXI/Mem0]
assign_bd_address -offset 0x1A000000 -range 16M -target_address_space [get_bd_addr_spaces jtag_axi_0/Data] [get_bd_addr_segs axi_cfg_flash/aximm/MEM0]
assign_bd_address -offset 0x1C000000 -range 64K -target_address_space [get_bd_addr_spaces jtag_axi_0/Data] [get_bd_addr_segs axi_ethernetlite_0/S_AXI/Reg]
assign_bd_address -offset 0x1C010000 -range 64K -target_address_space [get_bd_addr_spaces jtag_axi_0/Data] [get_bd_addr_segs axi_tft_0/S_AXI_MM/Reg]
assign_bd_address -offset 0x1C020000 -range 4K -target_address_space [get_bd_addr_spaces jtag_axi_0/Data] [get_bd_addr_segs apb_ps2_controller/APB/Reg]
assign_bd_address -offset 0x1C030000 -range 4K -target_address_space [get_bd_addr_spaces jtag_axi_0/Data] [get_bd_addr_segs nt35510_apb_adapter_0/APB/Reg]
assign_bd_address -offset 0x1C040000 -range 4K -target_address_space [get_bd_addr_spaces jtag_axi_0/Data] [get_bd_addr_segs axi_spi_flash/AXI_LITE/Reg]
assign_bd_address -offset 0x1C050000 -range 64K -target_address_space [get_bd_addr_spaces jtag_axi_0/Data] [get_bd_addr_segs v_frmbuf_rd_0/s_axi_CTRL/Reg]
assign_bd_address -offset 0x1C060000 -range 64K -target_address_space [get_bd_addr_spaces jtag_axi_0/Data] [get_bd_addr_segs v_frmbuf_wr_0/s_axi_CTRL/Reg]
assign_bd_address -offset 0x1C070000 -range 64K -target_address_space [get_bd_addr_spaces jtag_axi_0/Data] [get_bd_addr_segs utmi_usb_controller_0/cfg/reg0]
assign_bd_address -offset 0x1D000000 -range 64K -target_address_space [get_bd_addr_spaces jtag_axi_0/Data] [get_bd_addr_segs axi_intc_0/S_AXI/Reg]
assign_bd_address -offset 0x1FC00000 -range 128K -target_address_space [get_bd_addr_spaces jtag_axi_0/Data] [get_bd_addr_segs axi_bootrom_ctrl/S_AXI/Mem0]
assign_bd_address -offset 0x1FD02000 -range 8K -target_address_space [get_bd_addr_spaces jtag_axi_0/Data] [get_bd_addr_segs axi_uart16550_0/S_AXI/Reg]
assign_bd_address -offset 0x1FF00000 -range 64K -target_address_space [get_bd_addr_spaces jtag_axi_0/Data] [get_bd_addr_segs confreg_0/interface_aximm/reg0]
assign_bd_address -offset 0x00000000 -range 128M -target_address_space [get_bd_addr_spaces v_frmbuf_rd_0/Data_m_axi_mm_video] [get_bd_addr_segs mig_7series_0/memmap/memaddr]
assign_bd_address -offset 0x00000000 -range 128M -target_address_space [get_bd_addr_spaces v_frmbuf_wr_0/Data_m_axi_mm_video] [get_bd_addr_segs mig_7series_0/memmap/memaddr]

validate_bd_design
save_bd_design
